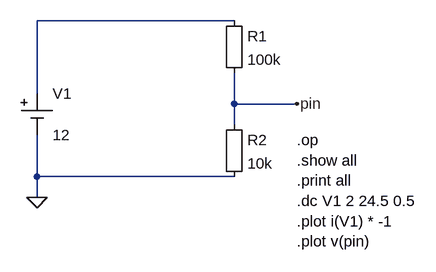
[diagram p0: schematic sensV.asc]
sensV.asc, the LTspice schematic file:
Version 4
SHEET 1 880 680
WIRE 272 192 -32 192
WIRE -32 304 -32 192
WIRE 272 320 272 272
WIRE 368 320 272 320
WIRE 272 352 272 320
WIRE -32 432 -32 368
WIRE 272 432 -32 432
WIRE -32 464 -32 432
FLAG -32 464 0
FLAG 368 320 pin
SYMBOL Misc/cell -32 304 R0
SYMATTR InstName V1
SYMATTR Value 12
SYMBOL Misc/EuropeanResistor 256 176 R0
SYMATTR InstName R1
SYMATTR Value 100k
SYMBOL Misc/EuropeanResistor 256 336 R0
SYMATTR InstName R2
SYMATTR Value 10k
TEXT 368 376 Left 2 !.op\n.show all\n.print all\n.dc V1 2 24.5 0.5\n.plot i(V1) * -1\n.plot v(pin)

The netlist it stands for:
* sensV.asc
V1 N001 0 12
R1 N001 pin 100k
R2 pin 0 10k
.op
.show all
.print all
.dc V1 2 24.5 0.5
.plot i(V1) * -1
.plot v(pin)
.backanno
.end